# Altium schematic sheet Sheet2.SchDoc
size A; SheetNumber: 2; SheetTotal: 2
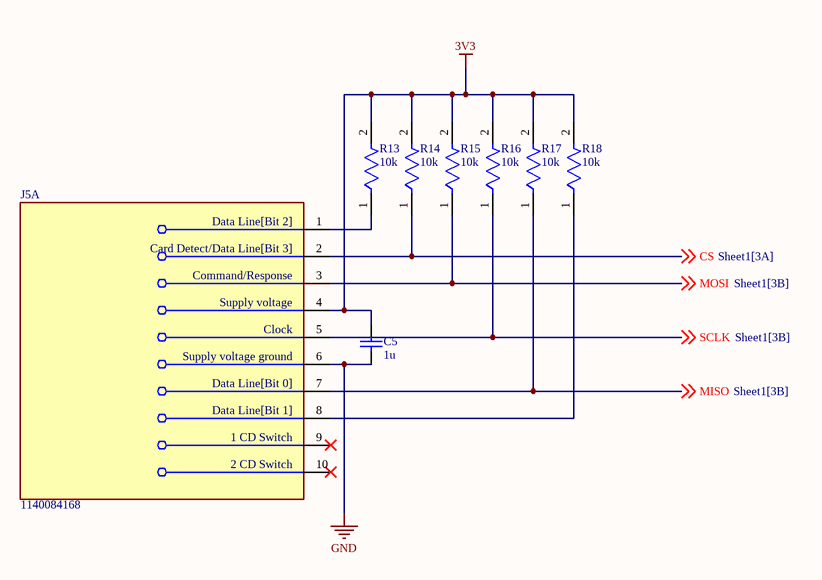
[diagram p0: Sheet2.SchDoc]

## Parts
C5  1u  [CAPC3216X110X50LL20T25]
J5  1140084168  [FP-1140084168-0]  (part A of 2)
R13  10k  [FP-CR1206-IPC_B]
R14  10k  [FP-CR1206-IPC_B]
R15  10k  [FP-CR1206-IPC_B]
R16  10k  [FP-CR1206-IPC_B]
R17  10k  [FP-CR1206-IPC_B]
R18  10k  [FP-CR1206-IPC_B]

## Nets
3V3: C5.2 J5.4(Supply_voltage) R13.2 R14.2 R15.2 R16.2 R17.2 R18.2
GND: C5.1 J5.6(Supply_voltage_ground)
CS: J5.2(Card_Detect/Data_Line[Bit_3]) R14.1 ; off-sheet CS
MISO: J5.7(Data_Line[Bit_0]) R17.1 ; off-sheet MISO
MOSI: J5.3(Command/Response) R15.1 ; off-sheet MOSI
SCLK: J5.5(Clock) R16.1 ; off-sheet SCLK
NetJ5_1: J5.1(Data_Line[Bit_2]) R13.1
NetJ5_8: J5.8(Data_Line[Bit_1]) R18.1

Not connected (* = marked no-connect by the designer): J5 9(1_CD_Switch)* 10(2_CD_Switch)*

## Library data of the parts
C5 = CMP-2000-06011-1: Chip Capacitor, 1 uF, +/- 10%, 50 V, -55 to 125 degC, 1206 (3216 Metric), RoHS, Tape and Reel; Manufacturer: Kemet; Case Height: 1mm; Dielectric: X7R; Voltage Rating: 50V; Capacitance: 1uF; Temperature Coefficient / Code: +/-15%; Case Length: 3.2mm; Case Width: 1.6mm; Type: SMDMLCCX7R6.3-250VDCCommericalGrade; Class: Class1; Capacitance - nF: 1000nF; Datasheet URL: http://www.kemet.com/docfinder?Partnumber=C1206C105K5RACTU; Product Category: MultilayerCeramicCapacitorsMLCC-SMD/SMT; Termination Style: SMD/SMT; Dimensions: 1.6mmWx3.2mmLx1mmH; Voltage Rating DC: 50V; Datasheet Version: 02/2016; Packaging: Reel; Brand: Kemet; RoHS: Details; Minimum Operating Temperature: -55C; Operating Temperature Range: -55Cto+125C; Package Reference: 1206; Manufacturer URL: http://www.kemet.com/; Product: GeneralTypeMLCCs; Tolerance: 10%; Package Description: 2-Pin Surface Mount Device, Body 3.2 x 1.6 mm; Mounting Technology: SurfaceMount; Case Code - mm: 3216; Maximum Operating Temperature: +125C; Series: C1206C; Factory Pack Quantity: 2500; Package / Case: 1206(3216metric); Case Code - in: 1206
J5 = CMP-02360-000003-1: CONN MICRO SD CARD PUSH-PULL R/A; Gender: Receptacle; Number of Contacts: 8; Connector Type: Connector; Pitch: 1.1mm; Lead Free: Lead Free; Housing Material: Polymer; Radiation Hardening: No; Mount: Surface Mount; Depth: 11.45mm; Number of Rows: 1; Height: 1.55mm; Contact Plating: Gold; Package Quantity: 7500; Packaging: Tape and Reel; Termination: SMD/SMT; Length: 15.6mm; Orientation: Right Angle; Flammability Rating: UL94 V-0; Contact Material: Copper Alloy
R13-R18 = CMP-07231-005593-1: Thick Film Chip Resistors 1206 10kΩ 0.25W 5% 200ppm/°C; Voltage Rating: 200V; Resistance: 10kR; Max Power Dissipation: 250mW; Temperature Coefficient: 200ppm/°C; Height: 0.6mm; Case Code (Imperial): 1206; REACH SVHC: No SVHC; Depth: 1.6mm; Mount: Surface Mount; Termination: SMD/SMT; Case/Package: 1206; Min Operating Temperature: -55°C; Features: Moisture Resistant; Number of Pins: 2; Length: 3.2mm; Military Standard: Not; Radiation Hardening: No; Max Operating Temperature: 155°C; Power Rating: 250mW; Case Code (Metric): 3216; Package Quantity: 1; Composition: Thick Film; Tolerance: 5%; Voltage Rating (DC): 200V; Contact Plating: Tin; Thickness: 610um; Number of Terminations: 2; Packaging: Tape and Reel; Width: 1.6mm